# EAGLE design midi_io (EAGLE 7.7.0)
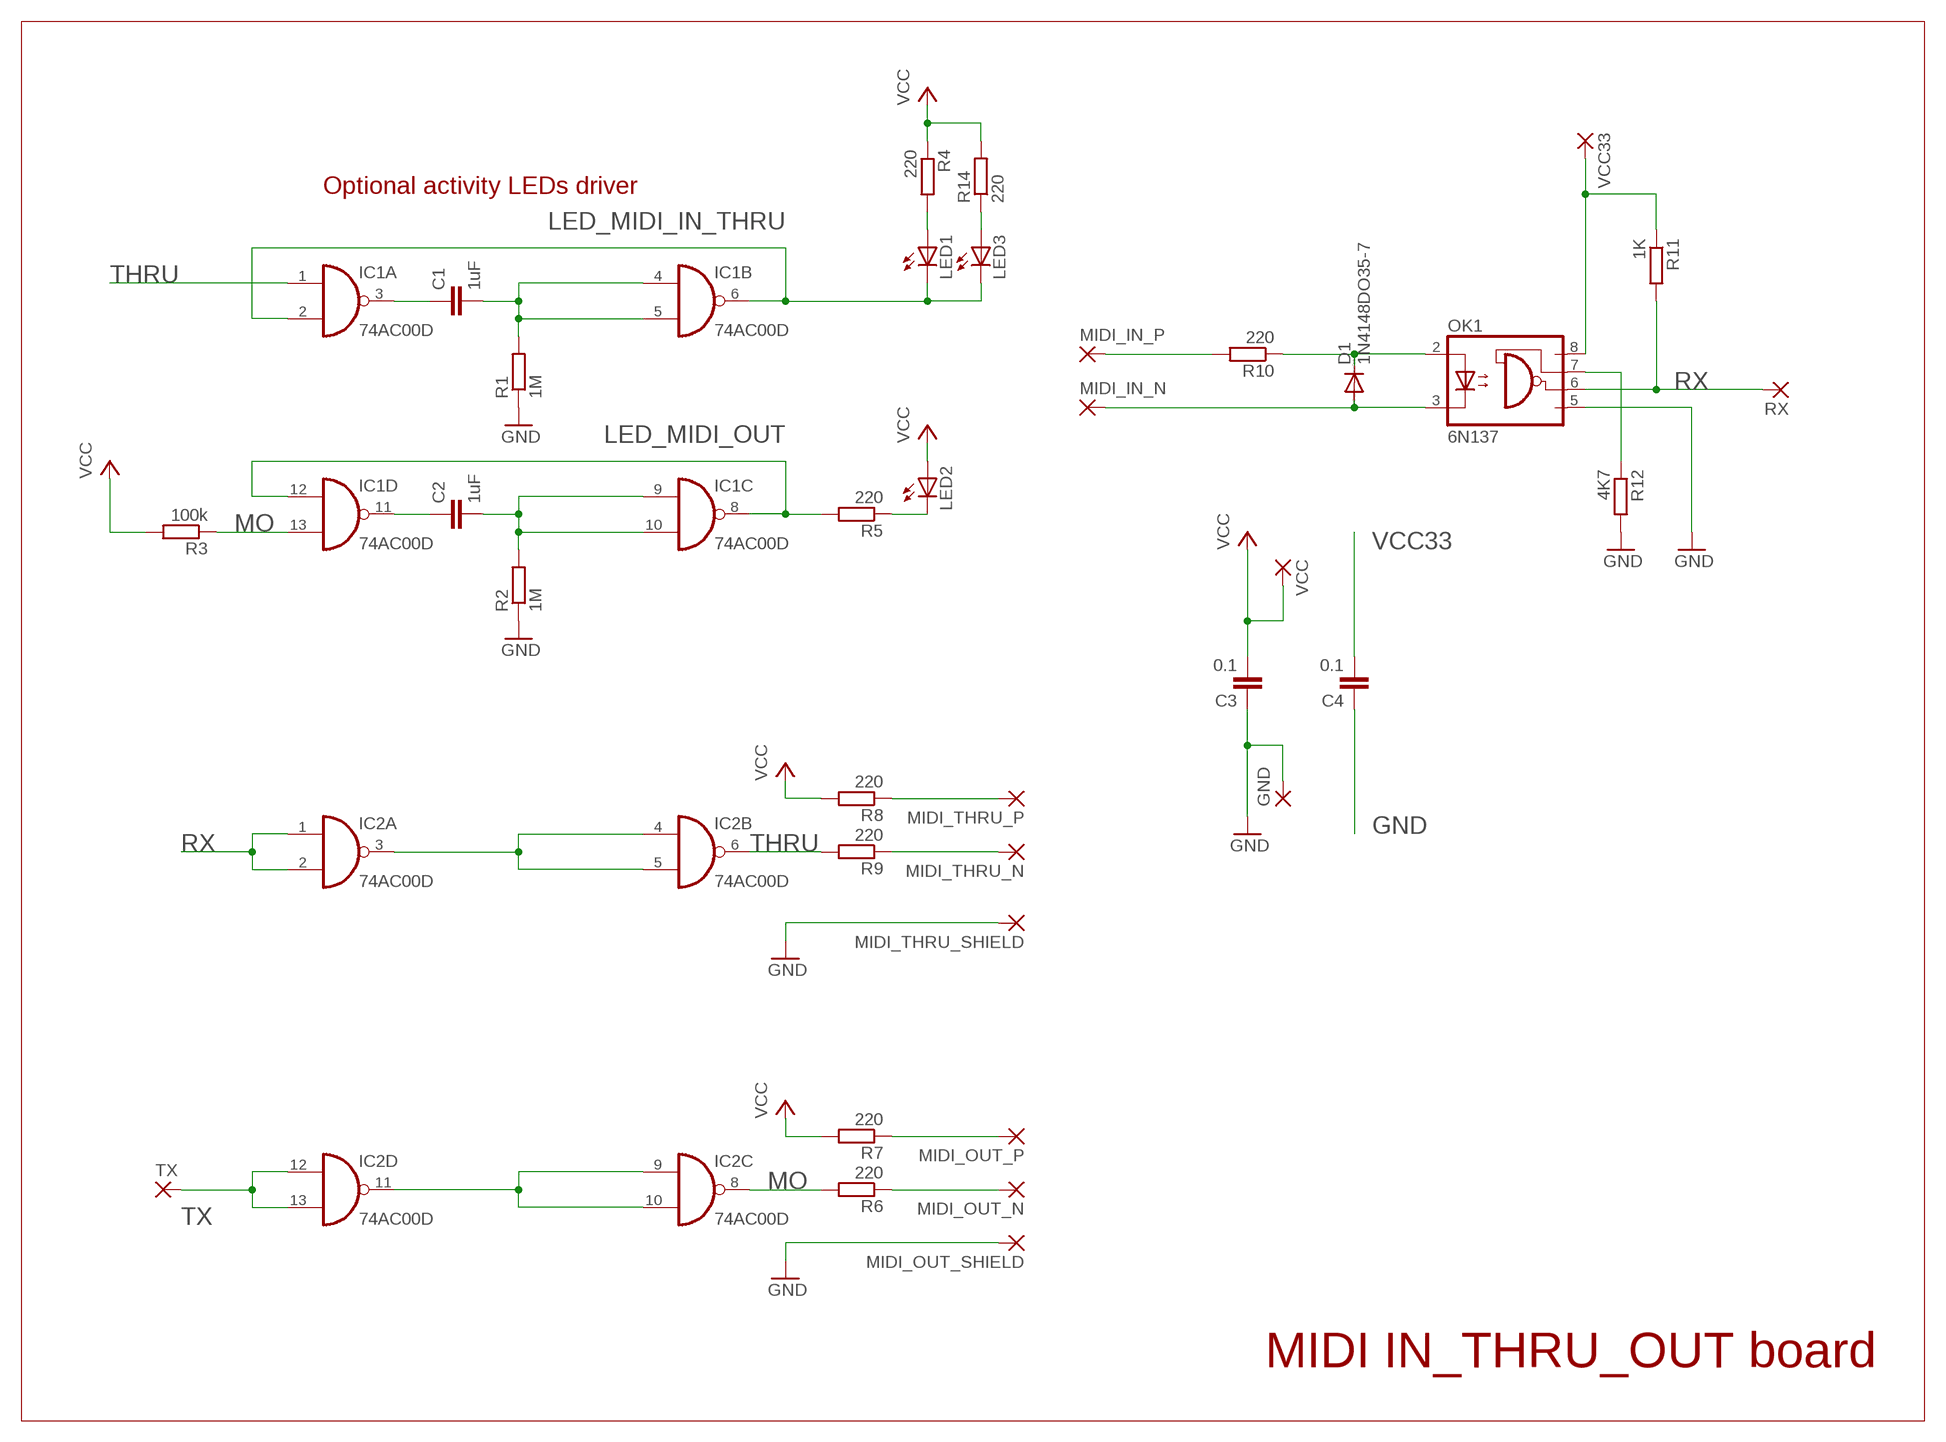
[diagram p0: schematic, sheet 1]

## Parts
C1  1uF  C-EUC0805  [C0805]
C2  1uF  C-EUC0805  [C0805]
C3  0.1  C-EUC0805  [C0805]
C4  0.1  C-EUC0805  [C0805]
D1  1N4148DO35-7  [DO35-7]
GND  1,6/0,8  [1,6/0,8]
IC1  74AC00D  [SO14]
IC2  74AC00D  [SO14]
LED1  LED3MM  [LED3MM]
LED2  LED3MM  [LED3MM]
LED3  LED3MM  [LED3MM]
MIDI_IN_N  1,6/0,8  [1,6/0,8]
MIDI_IN_P  1,6/0,8  [1,6/0,8]
MIDI_OUT_N  1,6/0,8  [1,6/0,8]
MIDI_OUT_P  1,6/0,8  [1,6/0,8]
MIDI_OUT_SHIELD  1,6/0,8  [1,6/0,8]
MIDI_THRU_N  1,6/0,8  [1,6/0,8]
MIDI_THRU_P  1,6/0,8  [1,6/0,8]
MIDI_THRU_SHIELD  1,6/0,8  [1,6/0,8]
OK1  6N137  [DIL08]
R1  1M  R-EU_M0805  [M0805]
R2  1M  R-EU_M0805  [M0805]
R3  100k  R-EU_M0805  [M0805]
R4  220  R-EU_0204/7  [0204/7]
R5  220  R-EU_M0805  [M0805]
R6  220  R-EU_0204/7  [0204/7]
R7  220  R-EU_0204/7  [0204/7]
R8  220  R-EU_0204/7  [0204/7]
R9  220  R-EU_0204/7  [0204/7]
R10  220  R-EU_0204/7  [0204/7]
R11  1K  R-EU_0204/7  [0204/7]
R12  4K7  R-EU_0204/7  [0204/7]
R14  220  R-EU_0617/17  [0617/17]
RX  1,6/0,8  [1,6/0,8]
TX  1,6/0,8  [1,6/0,8]
VCC  1,6/0,8  [1,6/0,8]
VCC33  1,6/0,8  [1,6/0,8]

## Nets
GND: C3.1 C4.1 GND.1(P) MIDI_OUT_SHIELD.1(P) MIDI_THRU_SHIELD.1(P) OK1.5(GND) R1.1 R2.1 R12.2
INV1: IC2.3(A:O) IC2.4(B:I0) IC2.5(B:I1)
INV2: IC2.9(C:I0) IC2.10(C:I1) IC2.11(D:O)
L2: LED2.K(C) R5.1
LED_MIDI_IN_THRU: IC1.2(A:I1) IC1.6(B:O) LED1.K(C) LED3.K(C)
LED_MIDI_OUT: IC1.8(C:O) IC1.12(D:I0) R5.2
MIDI_THRU_N: MIDI_THRU_N.1(P) R9.1
MIDI_THRU_P: MIDI_THRU_P.1(P) R8.1
MIDI_TX_N: MIDI_OUT_N.1(P) R6.1
MIDI_TX_P: MIDI_OUT_P.1(P) R7.1
MO: IC1.13(D:I1) IC2.8(C:O) R3.1 R6.2
N$1: OK1.7(VE) R12.1
N$2: LED1.A R4.2
N$4: LED3.A R14.1
N$5: D1.C OK1.2(A) R10.1
N$6: D1.A MIDI_IN_N.1(P) OK1.3(C)
N$7: MIDI_IN_P.1(P) R10.2
RC1: C1.2 IC1.4(B:I0) IC1.5(B:I1) R1.2
RC2: C2.2 IC1.9(C:I0) IC1.10(C:I1) R2.2
RX: IC2.1(A:I0) IC2.2(A:I1) OK1.6(VO) R11.2 RX.1(P)
THRU: IC1.1(A:I0) IC2.6(B:O) R9.2
TO_C1: C1.1 IC1.3(A:O)
TO_C2: C2.1 IC1.11(D:O)
TX: IC2.12(D:I0) IC2.13(D:I1) TX.1(P)
VCC: C3.2 LED2.A R3.2 R4.1 R7.2 R8.2 R14.2 VCC.1(P)
VCC33: C4.2 OK1.8(VCC) R11.1 VCC33.1(P)

## Notes on the sheet
- Optional activity LEDs driver
- MIDI IN_THRU_OUT board

## Power pins joined to a net without a drawn wire
GND: IC1.7(P:GND) IC2.7(P:GND)
VCC: IC1.14(P:VCC) IC2.14(P:VCC)

## Library data of the parts
C1-C4 = rcl:C-EU: CAPACITOR, European symbol
D1 = diode:1N4148: DIODE high speed (Philips)
GND MIDI_IN_N MIDI_IN_P MIDI_OUT_N MIDI_OUT_P MIDI_OUT_SHIELD MIDI_THRU_N MIDI_THRU_P MIDI_THRU_SHIELD RX TX VCC VCC33 = wirepad:1,6/0,8: THROUGH-HOLE PAD
IC1 IC2 = 74xx-eu:74*00: Quad 2-input NAND gate
LED1-LED3 = led:LED: LED OSRAM: - CHIPLED LG R971, LG N971, LY N971, LG Q971, LY Q971, LO R971, LY R971 LH N974, LH R974 LS Q976, LO Q976, LY Q976 LO Q996 - Hyper CHIPLED LW Q18S LB Q993, LB Q99A, LB R99A - SideLED LS A670, LO A670, LY A670, LG A670, LP A670 LB A673, LV A673, LT A673, LW A673 LH A674 LY A675 LS A676, LA A676, LO A676, LY A676, LW A676 LS A679, LY A679, LG A679 - Hyper Micro SIDELED® LS Y876, LA Y876, LO Y876, LY Y876 LT Y87S - SmartLED LW L88C, LW L88S LB L89C, LB L89S, LG L890 LS L89K, LO L89K, LY L89K LS L896, LA L896, LO L896, LY L896 - TOPLED LS T670, LO T670, LY T670, LG T670, LP T670 LSG T670, LSP T670, LSY T670, LOP T670, LYG T670 LG T671, LOG T671, LSG T671 LB T673, LV T673, LT T673, LW T673 LH T674 LS T676, LA T676, LO T676, LY T676, LB T676, LH T676, LSB T676, LW T676 LB T67C, LV T67C, LT T67C, LS T67K, LO T67K, LY T67K, LW E67C LS E67B, LA E67B, LO E67B, LY E67B, LB E67C, LV E67C, LT E67C LW T67C LS T679, LY T679, LG T679 LS T770, LO T770, LY T770, LG T770, LP T770 LB T773, LV T773, LT T773, LW T773 LH T774 LS E675, LA E675, LY E675, LS T675 LS T776, LA T776, LO T776, LY T776, LB T776 LHGB T686 LT T68C, LB T68C - Hyper Mini TOPLED® LB M676 - Mini TOPLED Santana® LG M470 LS M47K, LO M47K, LY M47K Source: http://www.osram.convergy.de LUXEON: - LUMILED® LXK2-PW12-R00, LXK2-PW12-S00, LXK2-PW14-U00, LXK2-PW14-V00 LXK2-PM12-R00, LXK2-PM12-S00, LXK2-PM14-U00 LXK2-PE12-Q00, LXK2-PE12-R00, LXK2-PE12-S00, LXK2-PE14-T00, LXK2-PE14-U00 LXK2-PB12-K00, LXK2-PB12-L00, LXK2-PB12-M00, LXK2-PB14-N00, LXK2-PB14-P00, LXK2-PB14-Q00 LXK2-PR12-L00, LXK2-PR12-M00, LXK2-PR14-Q00, LXK2-PR14-R00 LXK2-PD12-Q00, LXK2-PD12-R00, LXK2-PD12-S00 LXK2-PH12-R00, LXK2-PH12-S00 LXK2-PL12-P00, LXK2-PL12-Q00, LXK2-PL12-R00 Source: www.luxeon.com KINGBRIGHT: KA-3528ASYC Source: www.kingbright.com
OK1 = optocoupler:6N137: MOTOROLA OPTO COUPLER; MPN: 6N137; OC_FARNELL: 1328376; OC_NEWARK: 52M1895
R1-R12 R14 = rcl:R-EU_: RESISTOR, European symbol

## Board
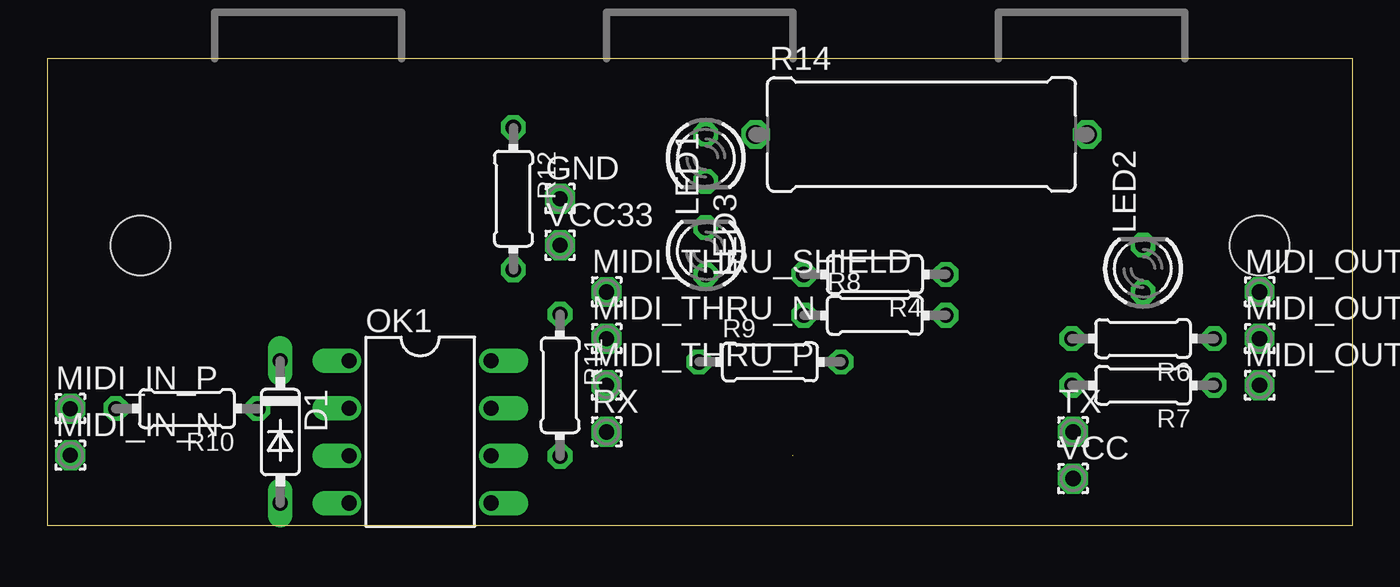
[diagram p1: board, top side]
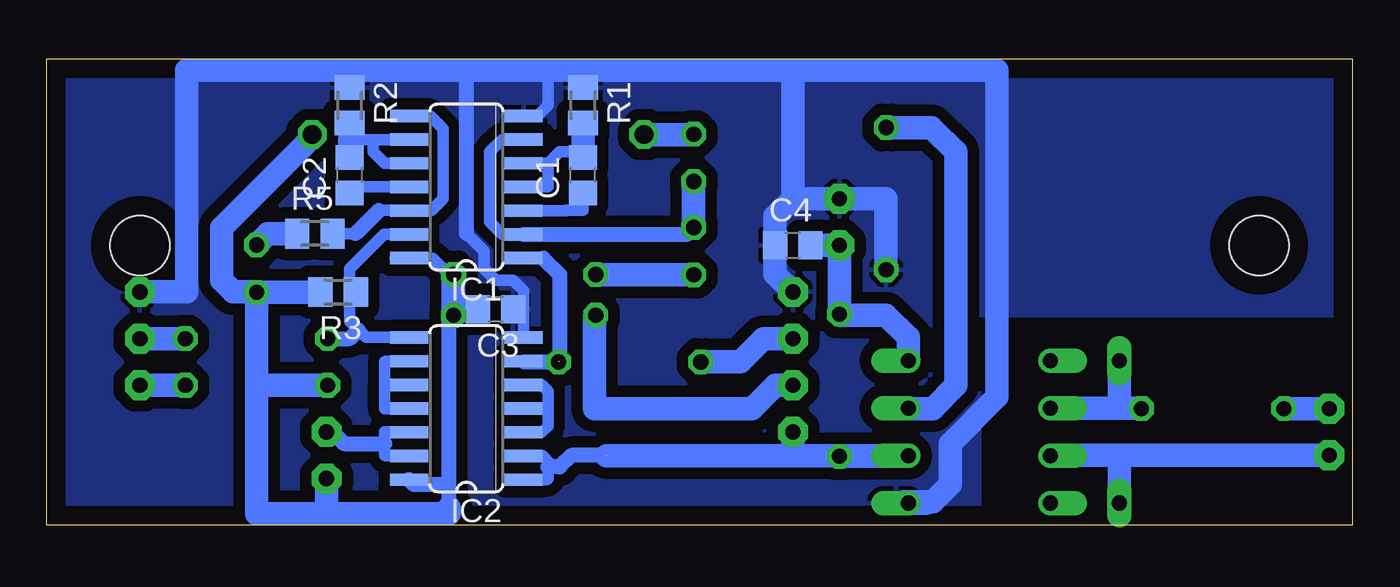
[diagram p2: board, bottom side, seen from below]

Size 70 x 25 mm. Coordinates in mm from the lower left corner, seen from the top.
Outline: 0,0 70,0 70,25 0,25 0,0
Copper layers (1*16): Top 0.035mm / dielectric 1.5mm / Bottom 0.035mm
Design rules "default": minimum track width 10mil, minimum drill 24mil, track to track 8mil, track to pad 8mil, pad to pad 8mil, via to via 8mil, smd to smd 8mil, copper to edge 40mil, drill to drill 8mil, minimum pad ring 10mil, minimum via ring 8mil, stop-mask expansion 4mil, vias tented up to drill 0mil, thermal gap 10mil
Holes 3.2 mm at 5,15 65,15

### Footprints (pad centres in the part's own frame; a part is rotated, then mirrored left to right if it is on the bottom)
C0805 = smd 1.3 x 1.5: 1 -0.95,0; 2 0.95,0
DO35-7 = drill 0.813 long: A 3.81,0; C -3.81,0
1,6/0,8 = drill 0.813 pad 1.6 octagon: 1 0,0
SO14 = smd 0.66 x 2.032: 1 -3.81,-3.073; 2 -2.54,-3.073; 3 -1.27,-3.073; 4 0,-3.073; 5 1.27,-3.073; 6 2.54,-3.073; 7 3.81,-3.073; 8 3.81,3.073; 9 2.54,3.073; 10 1.27,3.073; 11 0,3.073; 12 -1.27,3.073; 13 -2.54,3.073; 14 -3.81,3.073
LED3MM = drill 0.813 octagon: A -1.27,0; K 1.27,0
DIL08 = drill 0.813 offset: 1 -3.81,-3.81; 2 -1.27,-3.81; 3 1.27,-3.81; 4 3.81,-3.81; 5 3.81,3.81; 6 1.27,3.81; 7 -1.27,3.81; 8 -3.81,3.81
M0805 = smd 1.3 x 1.6: 1 -0.95,0; 2 0.95,0
0204/7 = drill 0.813 octagon: 1 -3.81,0; 2 3.81,0
0617/17 = drill 1.016 octagon: 1 -8.89,0; 2 8.89,0

### Placement (x,y rotation side)
C1  41.25,18.75 90 bottom
C2  53.75,18.75 90 bottom
C3  45.94,11.56 180 bottom
C4  30,15 0 bottom
D1  12.5,5 270 top
GND  27.5,17.5 0 top
IC1  47.5,18.12 90 bottom
IC2  47.5,6.25 90 bottom
LED1  35.31,14.69 90 top
LED2  58.75,13.75 90 top
LED3  35.31,19.69 270 top
MIDI_IN_N  1.25,3.75 0 top
MIDI_IN_P  1.25,6.25 0 top
MIDI_OUT_N  65,10 0 top
MIDI_OUT_P  65,7.5 0 top
MIDI_OUT_SHIELD  65,12.5 0 top
MIDI_THRU_N  30,10 0 top
MIDI_THRU_P  30,7.5 0 top
MIDI_THRU_SHIELD  30,12.5 0 top
OK1  20,5 270 top
R1  41.25,22.5 270 bottom
R2  53.75,22.5 270 bottom
R3  54.38,12.5 180 bottom
R4  44.38,13.44 180 top
R5  55.62,15.62 0 bottom
R6  58.75,10 180 top
R7  58.75,7.5 180 top
R8  44.38,11.25 0 top
R9  38.75,8.75 0 top
R10  7.5,6.25 180 top
R11  27.5,7.5 270 top
R12  25,17.5 270 top
R14  46.88,20.94 0 top
RX  30,5 0 top
TX  55,5 0 top
VCC  55,2.5 0 top
VCC33  27.5,15 0 top

### Tracks (layer width: path | path; a pad name or v marks a point on that pad's centre or on a via)
GND
  Bottom 0.61: 43.12,24.38 43.12,22.5 43.69,21.93 IC1.7 | 47.5,15.62 46.56,14.69 46.56,13.75 45.94,13.12 45,13.12 44.43,12.55 44.43,11.56 | IC2.7 44.43,11.56 | C3.1 44.43,11.56
  Bottom 0.813: 47.5,15.62 47.5,24.38
  Bottom 1.27: R1.1 41.25,24.38 | 41.25,24.38 43.12,24.38 47.5,24.38 53.75,24.38 | 53.75,24.38 53.75,24.06 | 53.75,24.06 R2.1 | 30,24.38 19.06,24.38 19.06,6.88 21.56,4.38 21.56,2.19 22.5,1.25 24.06,1.25 | 30,24.38 41.25,24.38 | 54.06,24.38 53.75,24.06 | 30,17.5 30,24.38 | MIDI_OUT_SHIELD.1 62.5,12.5 62.5,24.38 53.75,24.38 | OK1.5 22.87,1.19 | R12.2 25,17.5 30,17.5 | MIDI_THRU_SHIELD.1 30.95,13.45 C4.1 30.95,16.55 30,17.5
  pour Bottom (isolate 0.61): 0,25 0,11.25 20,11.25 20,0 70,0 70,25
INV1
  Bottom 0.61: IC2.3 43.46,4.98 43.12,5.31 43.12,6.25 | 43.12,6.25 43.12,7.19 43.46,7.52 IC2.5 | IC2.4 43.12,6.25
INV2
  Bottom 0.61: IC2.11 51.88,6.25 51.88,7.5 | 51.88,7.5 50.59,7.5 IC2.10 | IC2.9 51.84,8.79 51.88,8.75 51.88,7.5
L2
  Bottom 1.27: R5.1 58.15,15.62 LED2.K
LED_MIDI_IN_THRU
  Bottom 0.61: IC1.2 45.59,15.59 46.25,16.25 46.25,20 45.59,20.66 IC1.6
  Bottom 0.813: IC1.2 35.69,15.59 LED1.K
  Bottom 1.27: LED3.K LED1.K
LED_MIDI_OUT
  Bottom 0.61: IC1.8 49.44,21.93 48.75,21.25 48.75,17.5 49.4,16.86 IC1.12 50.59,16.88 52.19,16.88 | 53.44,15.62 R5.2
  Bottom 0.813: 52.19,16.88 53.44,15.62
MIDI_THRU_N
  Bottom 1.27: R9.1 32.81,8.75 31.56,10 MIDI_THRU_N.1
MIDI_THRU_P
  Bottom 1.27: MIDI_THRU_P.1 30.94,7.5 32.19,6.25 40.62,6.25 40.62,11.19 R8.1
MIDI_TX_N
  Bottom 1.27: MIDI_OUT_N.1 R6.1
MIDI_TX_P
  Bottom 1.27: MIDI_OUT_P.1 R7.1
MO
  Bottom 0.61: IC1.13 51.91,15.59 53.75,13.75 53.75,12.81 53.44,12.5 | 53.44,12.5 R3.1 | IC2.8 52.87,10.06 53.28,10.47 53.75,10.94 53.75,12.19 53.44,12.5
  Bottom 0.813: R6.2 53.75,10 53.28,10.47
N$1
  Bottom 1.27: R12.1 22.56,21.31 21.25,20 21.25,7.5 22.5,6.25 23.79,6.25 OK1.7
N$2
  Bottom 0.813: 40.55,13.42 R4.2
  Bottom 1.27: LED1.A 40.55,13.42
N$4
  Bottom 1.27: R14.1 37.79,20.94 35.33,20.94 | 35.33,20.94 LED3.A | 35.33,20.94 35.31,20.94
N$5
  Bottom 1.27: OK1.2 12.5,6.27 | 12.5,6.27 11.33,6.27 R10.1 | D1.C 12.5,6.27
N$6
  Bottom 1.27: MIDI_IN_N.1 12.5,3.75 | 12.5,3.75 16.17,3.75 OK1.3 | D1.A 12.5,3.75
N$7
  Bottom 1.27: MIDI_IN_P.1 R10.2
RC1
  Bottom 0.61: 41.57,20.02 C1.2 41.55,20 42.5,20 43.1,19.39 | IC1.5 43.1,19.39 | IC1.4 43.12,18.12 43.12,19.38 43.1,19.39
  Bottom 1.27: R1.2 C1.2
RC2
  Bottom 0.61: 53.49,21.29 R2.2 53.75,20.62 53.71,20.66 52.5,20.66 | 53.43,20.02 C2.2 53.45,19.39 | IC1.9 52.5,20.66 | IC1.10 51.9,19.39 52.5,20 52.5,20.66
  Bottom 1.27: C2.2 53.75,20.62
RX  (1 unrouted)
  Bottom 0.61: IC2.1 43.19,2.44 43.12,2.5 43.12,3.12 43.12,3.44 43.4,3.71 IC2.2
  Bottom 0.813: 40,3.75 41.88,3.75 42.5,3.12 43.12,3.12
  Bottom 1.27: OK1.6 25,3.73 | 25,3.73 30,3.73 | 30,3.73 39.98,3.73 | R11.2 25.04,3.69 25,3.73 | RX.1 30,3.73
THRU  (1 unrouted)
  Bottom 0.61: IC2.6 44.39,8.75 | IC1.1 43.38,14.31
  Bottom 0.813: 44.39,8.75 42.5,8.75 42.5,13.44 43.38,14.31
TO_C1
  Bottom 0.61: 41.57,17.48 C1.1 41.25,16.88 42.17,16.88 42.2,16.86 IC1.3
TO_C2
  Bottom 0.61: IC1.11 53.42,18.12 C2.1
TX
  Bottom 0.61: IC2.13 51.84,3.71 51.88,3.75 51.88,4.38 51.88,5 50.59,5 IC2.12
  Bottom 0.813: TX.1 54.69,5 54.06,4.38 51.88,4.38
VCC
  Bottom 0.61: 51.31,14.31 IC1.14 49.31,14.31 48.44,13.44 | C3.2 47.87,11.56 R8.2
  Bottom 0.813: 48.44,0.94 48.44,2.19 | 48.44,2.19 48.44,13.44 R4.1 | IC2.14 50.32,2.19 48.44,2.19
  Bottom 1.27: LED2.A 58.75,7.5 | 58.75,7.5 58.75,0.62 55,0.62 | R7.2 58.75,7.5 | 55,0.62 48.44,0.62 48.44,0.94 | R3.2 55.34,12.48 LED2.A | R4.1 R8.2 | VCC.1 55,0.62 | R14.2 55.77,20.8 60.62,15.94 60.62,13.12 60,12.5 58.77,12.5 LED2.A
VCC33
  Bottom 1.27: OK1.8 23.81,10.06 25,11.25 27.44,11.25 R11.1 VCC33.1 C4.2